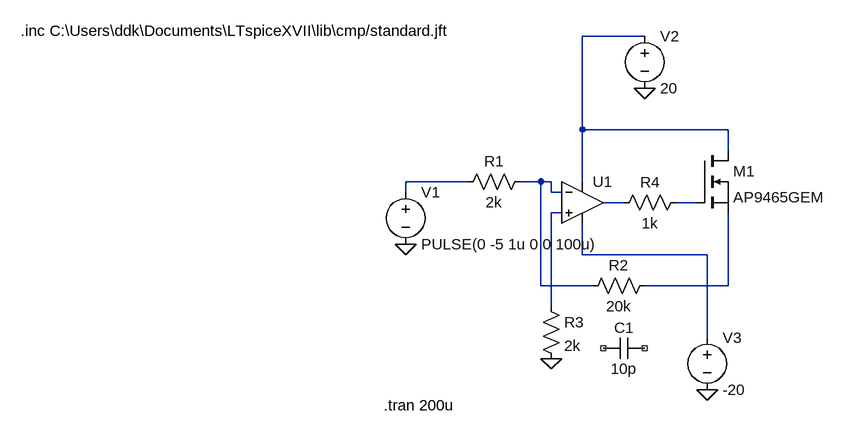
[diagram p0: schematic Draft2.asc]
Draft2.asc, the LTspice schematic file:
Version 4
SHEET 1 880 680
WIRE 208 -96 112 -96
WIRE 112 48 112 -96
WIRE 336 48 112 48
WIRE 336 80 336 48
WIRE -64 128 -160 128
WIRE 48 128 16 128
WIRE 64 128 48 128
WIRE 112 128 112 48
WIRE -160 144 -160 128
WIRE 64 144 64 128
WIRE 80 144 64 144
WIRE 176 160 144 160
WIRE 288 160 256 160
WIRE 80 176 64 176
WIRE 112 240 112 192
WIRE 304 240 112 240
WIRE 48 288 48 128
WIRE 128 288 48 288
WIRE 336 288 336 176
WIRE 336 288 208 288
WIRE 64 320 64 176
WIRE 304 368 304 240
FLAG 64 400 0
FLAG -160 224 0
FLAG 304 448 0
FLAG 208 -16 0
SYMBOL OpAmps\\UniversalOpAmp 112 160 R0
SYMATTR InstName U1
SYMBOL nmos 288 80 R0
SYMATTR InstName M1
SYMATTR Value AP9465GEM
SYMBOL voltage -160 128 R0
WINDOW 123 0 0 Left 0
WINDOW 39 0 0 Left 0
SYMATTR InstName V1
SYMATTR Value PULSE(0 -5 1u 0 0 100u)
SYMBOL res 32 112 R90
WINDOW 0 0 56 VBottom 2
WINDOW 3 32 56 VTop 2
SYMATTR InstName R1
SYMATTR Value 2k
SYMBOL res 224 272 R90
WINDOW 0 0 56 VBottom 2
WINDOW 3 32 56 VTop 2
SYMATTR InstName R2
SYMATTR Value 20k
SYMBOL cap 208 368 R90
WINDOW 0 0 32 VBottom 2
WINDOW 3 32 32 VTop 2
SYMATTR InstName C1
SYMATTR Value 10p
SYMBOL res 48 304 R0
SYMATTR InstName R3
SYMATTR Value 2k
SYMBOL voltage 208 -112 R0
WINDOW 123 0 0 Left 0
WINDOW 39 0 0 Left 0
SYMATTR InstName V2
SYMATTR Value 20
SYMBOL voltage 304 352 R0
WINDOW 123 0 0 Left 0
WINDOW 39 0 0 Left 0
SYMATTR InstName V3
SYMATTR Value -20
SYMBOL res 272 144 R90
WINDOW 0 0 56 VBottom 2
WINDOW 3 32 56 VTop 2
SYMATTR InstName R4
SYMATTR Value 1k
TEXT -194 472 Left 2 !.tran 200u
TEXT -752 -104 Left 2 !.inc C:\\Users\\ddk\\Documents\\LTspiceXVII\\lib\\cmp/standard.jft

The netlist it stands for:
* Draft2.asc
XU1 N006 N003 N001 N007 N004 level1 Avol=1Meg GBW=10Meg Vos=0 En=0 Enk=0 In=0 Ink=0 Rin=500Meg  ; pins In+ In- V+ V- OUT
M1 N001 N005 N008 N008 AP9465GEM
V1 N002 0 PULSE(0 -5 1u 0 0 100u)
R1 N003 N002 2k
R2 N008 N003 20k
C1 NC_01 NC_02 10p
R3 N006 0 2k
V2 N001 0 20
V3 N007 0 -20
R4 N005 N004 1k
.model NMOS NMOS
.model PMOS PMOS
.lib standard.mos
.tran 200u
.inc C:\Users\ddk\Documents\LTspiceXVII\lib\cmp/standard.jft
.lib UniversalOpAmp1.lib
.backanno
.end